# Altium project motor_crash_detection_device_pcb.PrjPcb
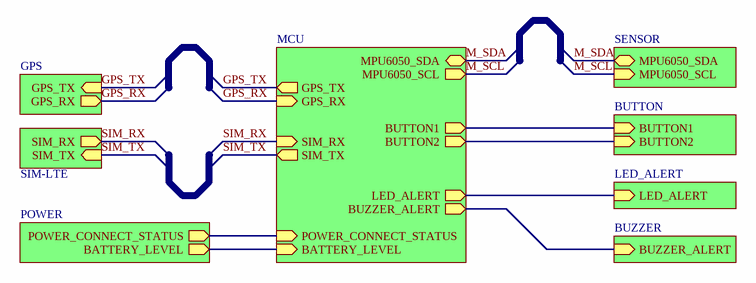
[diagram p0: Main.SchDoc]
9 sheets, 22 parts. Net scope: hierarchical (ports join the sheet entries above them; power ports are global).
Board file: motor_crash_detection_device_pcb.PcbDoc
Sheets:
  Main.SchDoc
    Designator = MCU.SchDoc
    Designator = SENSOR.SchDoc
    Designator = BUZZER.SchDoc
    Designator = LED_ALERT.SchDoc
    Designator = POWER.SchDoc
    Designator = GPS.SchDoc
    Designator = SIM-LTE.SchDoc
    Designator = BUTTON.SchDoc

## Sheet Main.SchDoc
size A4; Author: Khanh BK; Organization: DB Bach Khoa HN; Address1: Bach Khoa- HBT - HN; Address2: khanh.db192932; Address3: Youtube: Đào Bá Khánh; Address4: 0357698570; Revision: 1.0Ver; SheetNumber: 1; SheetTotal: 9

### Sub-sheets
Designator = MCU: SIM_TX (out), SIM_RX (in), POWER_CONNECT_STATUS (in), LED_ALERT (out), MPU6050_SDA (bidir), GPS_TX (out), GPS_RX (in), BUZZER_ALERT (out), BATTERY_LEVEL (in), MPU6050_SCL (out), BUTTON2 (out), BUTTON1 (out)
Designator = SENSOR: MPU6050_SDA (bidir), MPU6050_SCL (in)
Designator = BUZZER: BUZZER_ALERT (in)
Designator = LED_ALERT: LED_ALERT (in)
Designator = POWER: BATTERY_LEVEL (out), POWER_CONNECT_STATUS (out)
Designator = GPS: GPS_TX (in), GPS_RX (out)
Designator = SIM-LTE: SIM_RX (out), SIM_TX (in)
Designator = BUTTON: BUTTON1 (in), BUTTON2 (in)

### Nets
GPS_RX: sheet Designator/GPS_RX, sheet Designator/GPS_RX
GPS_TX: sheet Designator/GPS_TX, sheet Designator/GPS_TX
M_SCL: sheet Designator/MPU6050_SCL, sheet Designator/MPU6050_SCL
M_SDA: sheet Designator/MPU6050_SDA, sheet Designator/MPU6050_SDA
SIM_RX: sheet Designator/SIM_RX, sheet Designator/SIM_RX
SIM_TX: sheet Designator/SIM_TX, sheet Designator/SIM_TX
NetC1_8_2: sheet Designator/BUTTON1, sheet Designator/BUTTON1
NetC2_8_2: sheet Designator/BUTTON2, sheet Designator/BUTTON2
NetESP32_19: sheet Designator/POWER_CONNECT_STATUS, sheet Designator/POWER_CONNECT_STATUS
NetESP32_20: sheet Designator/BATTERY_LEVEL, sheet Designator/BATTERY_LEVEL
NetESP32_21: sheet Designator/BUZZER_ALERT, sheet Designator/BUZZER_ALERT
NetESP32_26: sheet Designator/LED_ALERT, sheet Designator/LED_ALERT

### Notes on the sheet
- Title
- Size:
- Date:
- Author:
- A4
- Time:
- Number:
- Checked:
- Revision:
- Sheet
- Approved:
- of
- File:

## Sheet MCU.SchDoc
size A4; Author: Khanh BK; Organization: DB Bach Khoa HN; Address1: Bach Khoa- HBT - HN; Address2: khanh.db192932; Address3: Youtube: Đào Bá Khánh; Address4: 0357698570; Revision: 1.0Ver; SheetNumber: 2; SheetTotal: 9
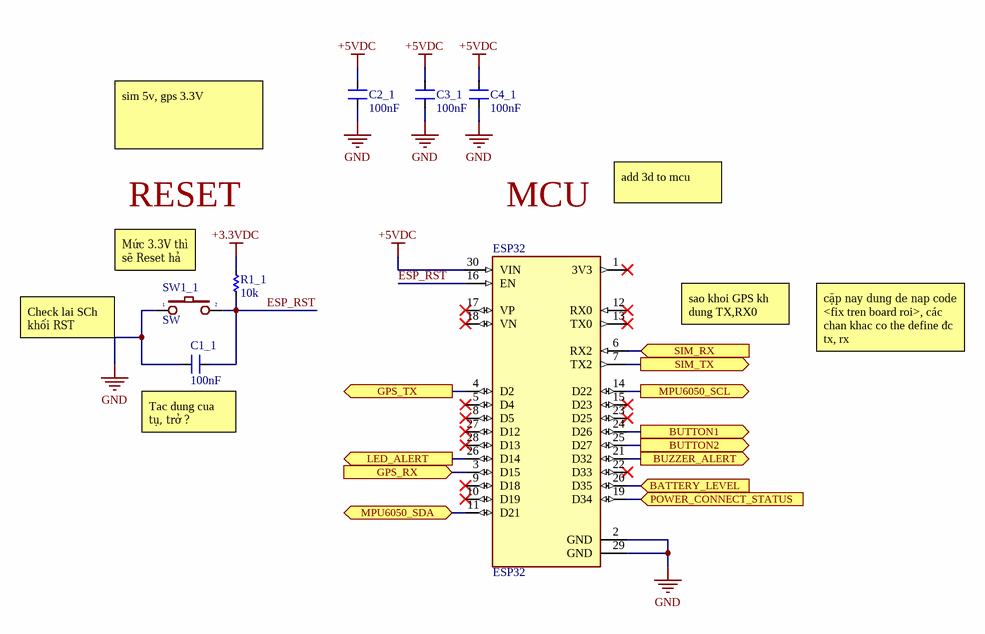
[diagram p1: MCU.SchDoc]

### Parts
C1_1  100nF  [CN-SMD-0805]
C2_1  100nF  [CN-SMD-0805]
C3_1  100nF  [CN-SMD-0805]
C4_1  100nF  [CN-SMD-0805]
ESP32  ESP32  [MODULE_ESP32_DEVKIT_V1]
R1_1  10k  [RES-SMD-0805]
SW1_1  SW  [SW1-DIP]

### Ports
BATTERY_LEVEL (in), BUTTON1 (out), BUTTON2 (out), BUZZER_ALERT (out), GPS_RX (in), GPS_TX (out), LED_ALERT (out), MPU6050_SCL (out), MPU6050_SDA (bidir), POWER_CONNECT_STATUS (in), SIM_RX (in), SIM_TX (out)

### Nets
+3.3VDC: R1_1.1
+5VDC: C2_1.2 C3_1.2 C4_1.2 ESP32.30(VIN)
GND: C1_1.1 C2_1.1 C3_1.1 C4_1.1 ESP32.2(GND) ESP32.29(GND) SW1_1.1
ESP_RST: C1_1.2 ESP32.16(EN) R1_1.2 SW1_1.2
GPS_RX: ESP32.3(D15) ; port GPS_RX
GPS_TX: ESP32.4(D2) ; port GPS_TX
M_SCL: ESP32.14(D22) ; port MPU6050_SCL
M_SDA: ESP32.11(D21) ; port MPU6050_SDA
SIM_RX: ESP32.6(RX2) ; port SIM_RX
SIM_TX: ESP32.7(TX2) ; port SIM_TX
NetC1_8_2: ESP32.24(D26) ; port BUTTON1
NetC2_8_2: ESP32.25(D27) ; port BUTTON2
NetESP32_19: ESP32.19(D34) ; port POWER_CONNECT_STATUS
NetESP32_20: ESP32.20(D35) ; port BATTERY_LEVEL
NetESP32_21: ESP32.21(D32) ; port BUZZER_ALERT
NetESP32_26: ESP32.26(D14) ; port LED_ALERT

Not connected (* = marked no-connect by the designer): ESP32 1(3V3)* 5(D4)* 8(D5)* 9(D18)* 10(D19)* 12(RX0)* 13(TX0)* 15(D23)* 17(VP)* 18(VN)* 22(D33)* 23(D25)* 27(D12)* 28(D13)*

### Notes on the sheet
- sim 5v, gps 3.3V
- RESET
- MCU
- add 3d to mcu
- Mức 3.3V thì sẽ Reset hả ?
- sao khoi GPS kh dung TX,RX0
- Check lai SCh khối RST
- cặp nay dung de nap code <fix tren board roi>, các chan khac co the define đc tx, rx
- (near C1_1) Tac dung cua tụ, trở ?
- Title
- Size:
- Date:
- Author:
- A4
- Time:
- Number:
- Checked:
- Revision:
- Sheet
- Approved:
- of
- File:

### Library data of the parts
C1_1 C2_1 C3_1 C4_1 = CN: Value: 33pF
ESP32 = ESP32-DEVKIT-V1: Dual core, Wi-Fi: 2.4 GHz up to 150 Mbits/s,BLE (Bluetooth Low Energy) and legacy Bluetooth, 32 bits, Up to 240 MHz; Value: *; MP: ESP32-DEVKIT-V1; Availability: Unavailable; Package: None; Price: None
R1_1 = Res-SMD: Resistor; Manufacturer: Generic Components; Class: Passive; Published: 08/06/2000; Publisher: Altium Hobart Technology Centre
SW1_1 = SW2: Switch button 2 pin; Value: SW chip 2 pin

## Sheet SENSOR.SchDoc
size A4; Author: Khanh BK; Organization: DB Bach Khoa HN; Address1: Bach Khoa- HBT - HN; Address2: khanh.db192932; Address3: Youtube: Đào Bá Khánh; Address4: 0357698570; Revision: 1.0Ver; SheetNumber: 4; SheetTotal: 9
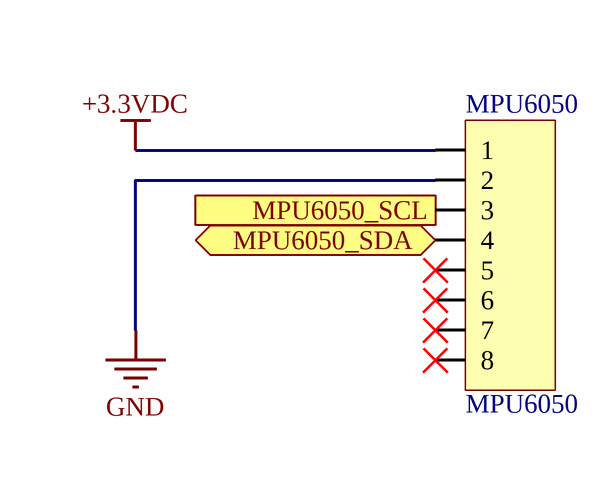
[diagram p2: SENSOR.SchDoc]

### Parts
MPU6050  MPU6050  [JP8-C1T]

### Ports
MPU6050_SCL (in), MPU6050_SDA (bidir)

### Nets
+3.3VDC: MPU6050.1
GND: MPU6050.2
M_SCL: MPU6050.3 ; port MPU6050_SCL
M_SDA: MPU6050.4 ; port MPU6050_SDA

Not connected (* = marked no-connect by the designer): MPU6050 5* 6* 7* 8*

### Notes on the sheet
- Title
- Size:
- Date:
- Author:
- A4
- Time:
- Number:
- Checked:
- Revision:
- Sheet
- Approved:
- of
- File:

### Library data of the parts
MPU6050 = JP8: WR-PHD 2.54 mm Angled Socket Header; Manufacturer: W¨¹rth Elektronik eiSos GmbH; partNo: 613008143121; ComponentLink1 Description: Manufacturer; ComponentLink2 Description: Datasheet; NoPins: 08; Created Date: 29 March 2013; ComponentLink1URL: http://www.we-online.com; ComponentLink2URL: http://katalog.we-online.de/em/datasheet/6130xx143121.pdf; Created by: Karrer Zheng

## Sheet BUZZER.SchDoc
size A4; Author: Khanh BK; Organization: DB Bach Khoa HN; Address1: Bach Khoa- HBT - HN; Address2: khanh.db192932; Address3: Youtube: Đào Bá Khánh; Address4: 0357698570; Revision: 1.0Ver; SheetNumber: 5; SheetTotal: 9
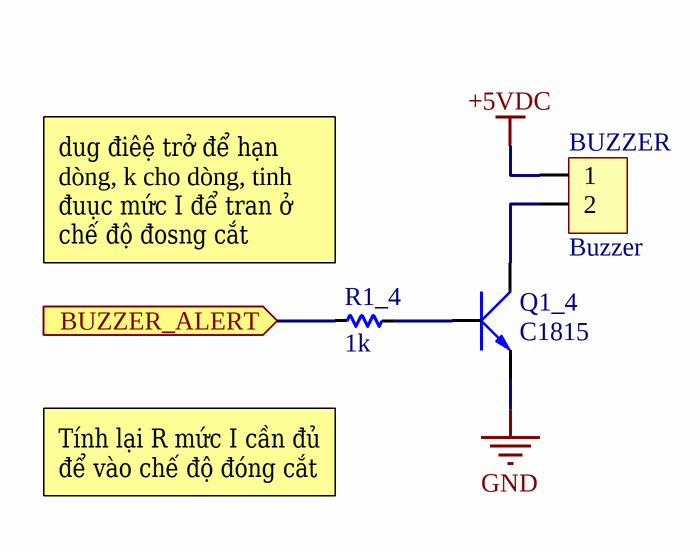
[diagram p3: BUZZER.SchDoc]

### Parts
BUZZER  Buzzer  [Header2]
Q1_4  C1815  [SOT23-321]
R1_4  1k  [RES-SMD-0805]

### Ports
BUZZER_ALERT (in)

### Nets
+5VDC: BUZZER.1
GND: Q1_4.1(E)
NetBUZZER_2: BUZZER.2 Q1_4.2(C)
NetESP32_21: R1_4.2 ; port BUZZER_ALERT
NetQ1_4_3: Q1_4.3(B) R1_4.1

### Notes on the sheet
- (near R1_4) dug điêệ trở để hạn dòng, k cho dòng, tinh đuục mức I để tran ở chế độ đosng cắt
- (near R1_4) Tính lại R mức I cần đủ để vào chế độ đóng cắt
- Title
- Size:
- Date:
- Author:
- A4
- Time:
- Number:
- Checked:
- Revision:
- Sheet
- Approved:
- of
- File:

### Library data of the parts
BUZZER = Header2: Header IDC, 2 x 1 Pin Vertical 2.54mm Pitch (Non-Boxed, Male); Manufacturer: W¨¹rth Elektronik eiSos GmbH; partNo: 613002143121; ComponentLink1 Description: Manufacturer; ComponentLink2 Description: Datasheet; NoPins: 02; Created Date: 29 March 2013; ComponentLink1URL: http://www.we-online.com; ComponentLink2URL: http://katalog.we-online.de/em/datasheet/6130xx143121.pdf; Created by: Karrer Zheng
Q1_4 = 2SC1815: NPN 600mW, ECB; Value: C1815
R1_4 = Res-SMD: as R1_1 on sheet MCU; Published: 08/06/2000; Publisher: Altium Hobart Technology Centre

## Sheet LED_ALERT.SchDoc
size A4; Author: Khanh BK; Organization: DB Bach Khoa HN; Address1: Bach Khoa- HBT - HN; Address2: khanh.db192932; Address3: Youtube: Đào Bá Khánh; Address4: 0357698570; Revision: 1.0Ver; SheetNumber: 7; SheetTotal: 9
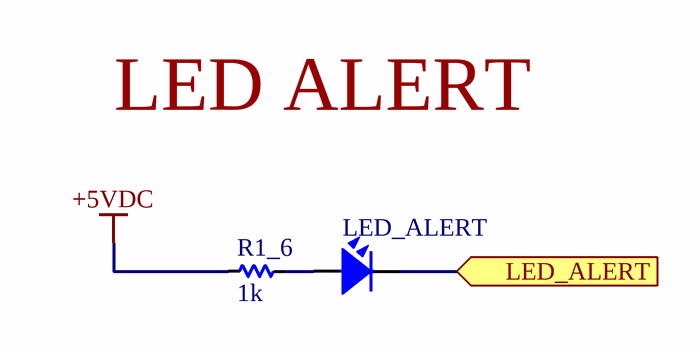
[diagram p4: LED_ALERT.SchDoc]

### Parts
LED_ALERT  LED  [LED-3MM-GREEN]  (value not drawn)
R1_6  1k  [RES-SMD-0805]

### Ports
LED_ALERT (in)

### Nets
+5VDC: R1_6.2
NetESP32_26: LED_ALERT.2 ; port LED_ALERT
NetLED_ALERT_1: LED_ALERT.1 R1_6.1

### Notes on the sheet
- LED ALERT
- Title
- Size:
- Date:
- Author:
- A4
- Time:
- Number:
- Checked:
- Revision:
- Sheet
- Approved:
- of
- File:

### Library data of the parts
LED_ALERT = LED: LED Single colour Green and Red; Value: LED 3 ly Single Colour
R1_6 = Res-SMD: as R1_1 on sheet MCU; Published: 08/06/2000; Publisher: Altium Hobart Technology Centre

## Sheet POWER.SchDoc
size A; SheetNumber: 3; SheetTotal: 6

## Sheet GPS.SchDoc
size A4; Author: Khanh BK; Organization: DB Bach Khoa HN; Address1: Bach Khoa- HBT - HN; Address2: khanh.db192932; Address3: Youtube: Đào Bá Khánh; Address4: 0357698570; Revision: 1.0Ver; SheetNumber: 6; SheetTotal: 9
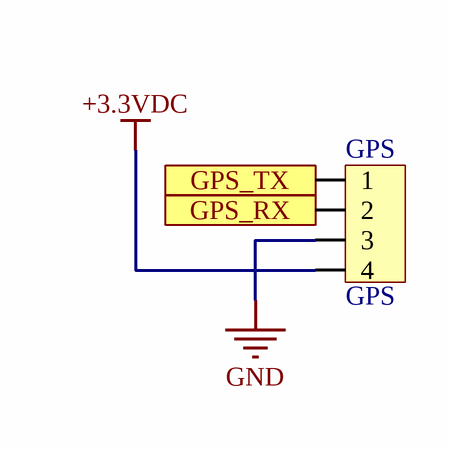
[diagram p5: GPS.SchDoc]

### Parts
GPS  GPS  [Header4]

### Ports
GPS_RX (out), GPS_TX (in)

### Nets
+3.3VDC: GPS.4
GND: GPS.3
GPS_RX: GPS.2 ; port GPS_RX
GPS_TX: GPS.1 ; port GPS_TX

### Notes on the sheet
- Title
- Size:
- Date:
- Author:
- A4
- Time:
- Number:
- Checked:
- Revision:
- Sheet
- Approved:
- of
- File:

### Library data of the parts
GPS = Header4: Header IDC, 4 x 1 Pin Vertical 2.54mm Pitch (Non-Boxed, Male); Manufacturer: W¨¹rth Elektronik eiSos GmbH; partNo: 613002143121; ComponentLink1 Description: Manufacturer; ComponentLink2 Description: Datasheet; NoPins: 02; Created Date: 29 March 2013; ComponentLink1URL: http://www.we-online.com; ComponentLink2URL: http://katalog.we-online.de/em/datasheet/6130xx143121.pdf; Created by: Karrer Zheng

## Sheet SIM-LTE.SchDoc
size A; SheetNumber: 8; SheetTotal: 9
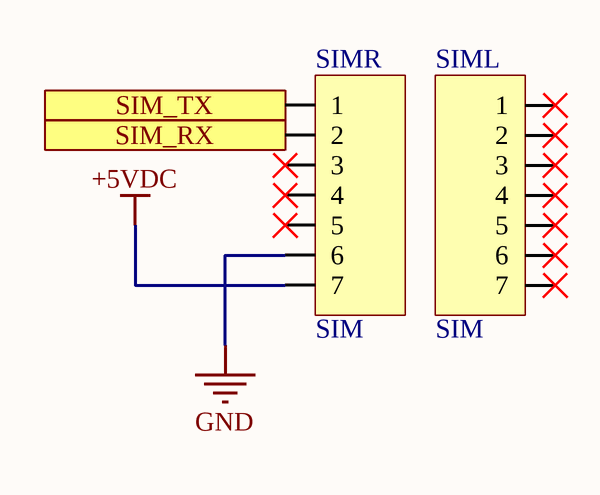
[diagram p6: SIM-LTE.SchDoc]

### Parts
SIML  SIM  [JP7-C1T]
SIMR  SIM  [JP7-C1T]

### Ports
SIM_RX (out), SIM_TX (in)

### Nets
+5VDC: SIMR.7
GND: SIMR.6
SIM_RX: SIMR.2 ; port SIM_RX
SIM_TX: SIMR.1 ; port SIM_TX

Not connected (* = marked no-connect by the designer): SIML 1* 2* 3* 4* 5* 6* 7*; SIMR 3* 4* 5*

### Library data of the parts
SIML SIMR = JP7: WR-PHD 2.54 mm Angled Socket Header; Manufacturer: W¨¹rth Elektronik eiSos GmbH; partNo: 613007143121; ComponentLink1 Description: Manufacturer; ComponentLink2 Description: Datasheet; NoPins: 07; Created Date: 29 March 2013; ComponentLink1URL: http://www.we-online.com; ComponentLink2URL: http://katalog.we-online.de/em/datasheet/6130xx143121.pdf; Created by: Karrer Zheng

## Sheet BUTTON.SchDoc
size A; SheetNumber: 9; SheetTotal: 9
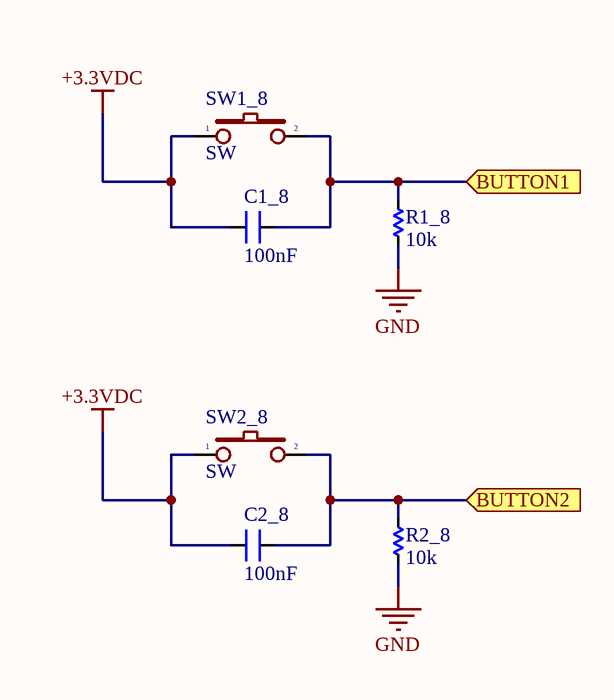
[diagram p7: BUTTON.SchDoc]

### Parts
C1_8  100nF  [CN-SMD-0805]
C2_8  100nF  [CN-SMD-0805]
R1_8  10k  [RES-SMD-0805]
R2_8  10k  [RES-SMD-0805]
SW1_8  SW  [SW1-DIP]
SW2_8  SW  [SW1-DIP]

### Ports
BUTTON1 (in), BUTTON2 (in)

### Nets
+3.3VDC: C1_8.1 C2_8.1 SW1_8.1 SW2_8.1
GND: R1_8.2 R2_8.2
NetC1_8_2: C1_8.2 R1_8.1 SW1_8.2 ; port BUTTON1
NetC2_8_2: C2_8.2 R2_8.1 SW2_8.2 ; port BUTTON2

### Library data of the parts
C1_8 C2_8 = CN: Value: 33pF
R1_8 R2_8 = Res-SMD: as R1_1 on sheet MCU; Published: 08/06/2000; Publisher: Altium Hobart Technology Centre
SW1_8 SW2_8 = SW2: as SW1_1 on sheet MCU

## Nets that join several sheets
+3.3VDC: MCU (R1_1.1), SENSOR (MPU6050.1), GPS (GPS.4), BUTTON (C1_8.1 C2_8.1 SW1_8.1 SW2_8.1)
+5VDC: MCU (C2_1.2 C3_1.2 C4_1.2 ESP32.30), BUZZER (BUZZER.1), LED_ALERT (R1_6.2), SIM-LTE (SIMR.7)
GND: MCU (7 pins), SENSOR (MPU6050.2), BUZZER (Q1_4.1), GPS (GPS.3), SIM-LTE (SIMR.6), BUTTON (R1_8.2 R2_8.2)
GPS_RX: MCU (ESP32.3), GPS (GPS.2)
GPS_TX: MCU (ESP32.4), GPS (GPS.1)
M_SCL: MCU (ESP32.14), SENSOR (MPU6050.3)
M_SDA: MCU (ESP32.11), SENSOR (MPU6050.4)
NetC1_8_2: MCU (ESP32.24), BUTTON (C1_8.2 R1_8.1 SW1_8.2)
NetC2_8_2: MCU (ESP32.25), BUTTON (C2_8.2 R2_8.1 SW2_8.2)
NetESP32_21: MCU (ESP32.21), BUZZER (R1_4.2)
NetESP32_26: MCU (ESP32.26), LED_ALERT (LED_ALERT.2)
SIM_RX: MCU (ESP32.6), SIM-LTE (SIMR.2)
SIM_TX: MCU (ESP32.7), SIM-LTE (SIMR.1)